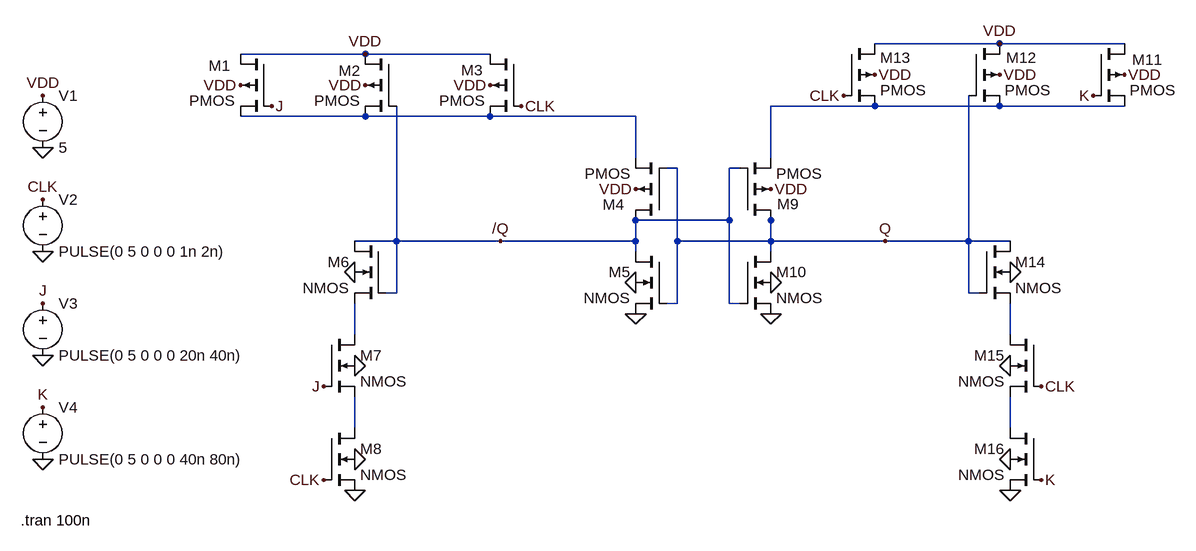
[diagram p0: schematic JK Latch.asc]
JK Latch.asc, the LTspice schematic file:
Version 4
SHEET 1 2116 752
WIRE 1680 0 1488 0
WIRE 1872 0 1680 0
WIRE 704 16 512 16
WIRE 896 16 704 16
WIRE 1488 96 1328 96
WIRE 1680 96 1488 96
WIRE 1872 96 1680 96
WIRE 704 112 512 112
WIRE 896 112 704 112
WIRE 1120 112 896 112
WIRE 1120 176 1120 112
WIRE 1328 176 1328 96
WIRE 1184 192 1168 192
WIRE 1280 192 1264 192
WIRE 1120 272 1120 256
WIRE 1264 272 1264 192
WIRE 1264 272 1120 272
WIRE 1328 272 1328 256
WIRE 752 304 752 96
WIRE 752 304 688 304
WIRE 912 304 752 304
WIRE 1120 304 1120 272
WIRE 1120 304 912 304
WIRE 1184 304 1184 192
WIRE 1328 304 1328 272
WIRE 1328 304 1184 304
WIRE 1504 304 1328 304
WIRE 1632 304 1632 80
WIRE 1632 304 1504 304
WIRE 1696 304 1632 304
WIRE 1120 320 1120 304
WIRE 1328 320 1328 304
WIRE 752 384 752 304
WIRE 752 384 736 384
WIRE 1632 384 1632 304
WIRE 1648 384 1632 384
WIRE 1184 400 1184 304
WIRE 1184 400 1168 400
WIRE 1264 400 1264 272
WIRE 1280 400 1264 400
WIRE 688 448 688 400
WIRE 1696 448 1696 400
WIRE 688 592 688 544
WIRE 1696 592 1696 544
FLAG 208 160 0
FLAG 208 320 0
FLAG 208 640 0
FLAG 208 480 0
FLAG 688 352 0
FLAG 688 496 0
FLAG 688 640 0
FLAG 1120 368 0
FLAG 688 688 0
FLAG 1328 368 0
FLAG 1696 352 0
FLAG 1696 496 0
FLAG 1696 640 0
FLAG 1696 688 0
FLAG 208 80 VDD
FLAG 512 64 VDD
FLAG 704 64 VDD
FLAG 896 64 VDD
FLAG 1488 48 VDD
FLAG 1680 48 VDD
FLAG 1872 48 VDD
FLAG 1120 224 VDD
FLAG 1328 224 VDD
FLAG 208 240 CLK
FLAG 944 96 CLK
FLAG 1440 80 CLK
FLAG 1744 528 CLK
FLAG 640 528 J
FLAG 208 400 J
FLAG 560 96 J
FLAG 1744 672 K
FLAG 1824 80 K
FLAG 1120 416 0
FLAG 1328 416 0
FLAG 208 560 K
FLAG 640 672 CLK
FLAG 1504 304 Q
FLAG 912 304 /Q
FLAG 704 16 VDD
FLAG 1680 0 VDD
SYMBOL voltage 208 64 R0
WINDOW 123 0 0 Left 0
WINDOW 39 0 0 Left 0
SYMATTR InstName V1
SYMATTR Value 5
SYMBOL voltage 208 224 R0
WINDOW 123 0 0 Left 0
WINDOW 39 0 0 Left 0
SYMATTR InstName V2
SYMATTR Value PULSE(0 5 0 0 0 1n 2n)
SYMBOL voltage 208 384 R0
WINDOW 123 0 0 Left 0
WINDOW 39 0 0 Left 0
SYMATTR InstName V3
SYMATTR Value PULSE(0 5 0 0 0 20n 40n)
SYMBOL voltage 208 544 R0
WINDOW 123 0 0 Left 0
WINDOW 39 0 0 Left 0
SYMATTR InstName V4
SYMATTR Value PULSE(0 5 0 0 0 40n 80n)
SYMBOL pmos4 560 16 M0
WINDOW 0 63 18 Left 2
SYMATTR InstName M1
SYMBOL pmos4 752 16 M0
WINDOW 0 55 26 Left 2
SYMATTR InstName M2
SYMBOL pmos4 944 16 M0
WINDOW 0 59 25 Left 2
SYMATTR InstName M3
SYMBOL pmos4 1168 272 R180
WINDOW 0 65 24 Left 2
SYMATTR InstName M4
SYMBOL nmos4 1168 320 M0
SYMATTR InstName M5
SYMBOL nmos4 736 304 M0
SYMATTR InstName M6
SYMBOL nmos4 640 448 R0
SYMATTR InstName M7
SYMBOL nmos4 640 592 R0
SYMATTR InstName M8
SYMBOL pmos4 1280 272 M180
WINDOW 0 58 25 Left 2
SYMATTR InstName M9
SYMBOL nmos4 1280 320 R0
SYMATTR InstName M10
SYMBOL pmos4 1824 0 R0
WINDOW 0 60 25 Left 2
SYMATTR InstName M11
SYMBOL pmos4 1632 0 R0
WINDOW 0 58 22 Left 2
SYMATTR InstName M12
SYMBOL pmos4 1440 0 R0
WINDOW 0 56 22 Left 2
SYMATTR InstName M13
SYMBOL nmos4 1648 304 R0
SYMATTR InstName M14
SYMBOL nmos4 1744 448 M0
SYMATTR InstName M15
SYMBOL nmos4 1744 592 M0
SYMATTR InstName M16
TEXT 174 734 Left 2 !.tran 100n

The netlist it stands for:
* JK Latch.asc
V1 VDD 0 5
V2 CLK 0 PULSE(0 5 0 0 0 1n 2n)
V3 J 0 PULSE(0 5 0 0 0 20n 40n)
V4 K 0 PULSE(0 5 0 0 0 40n 80n)
M1 VDD J N002 VDD PMOS
M2 VDD /Q N002 VDD PMOS
M3 VDD CLK N002 VDD PMOS
M4 /Q Q N002 VDD PMOS
M5 /Q Q 0 0 NMOS
M6 /Q /Q N003 0 NMOS
M7 N003 J N005 0 NMOS
M8 N005 CLK 0 0 NMOS
M9 Q /Q N001 VDD PMOS
M10 Q /Q 0 0 NMOS
M11 VDD K N001 VDD PMOS
M12 VDD Q N001 VDD PMOS
M13 VDD CLK N001 VDD PMOS
M14 Q Q N004 0 NMOS
M15 N004 CLK N006 0 NMOS
M16 N006 K 0 0 NMOS
.model NMOS NMOS
.model PMOS PMOS
.lib standard.mos
.tran 100n
.backanno
.end